# EAGLE design line_adapter (EAGLE 8.5.2)
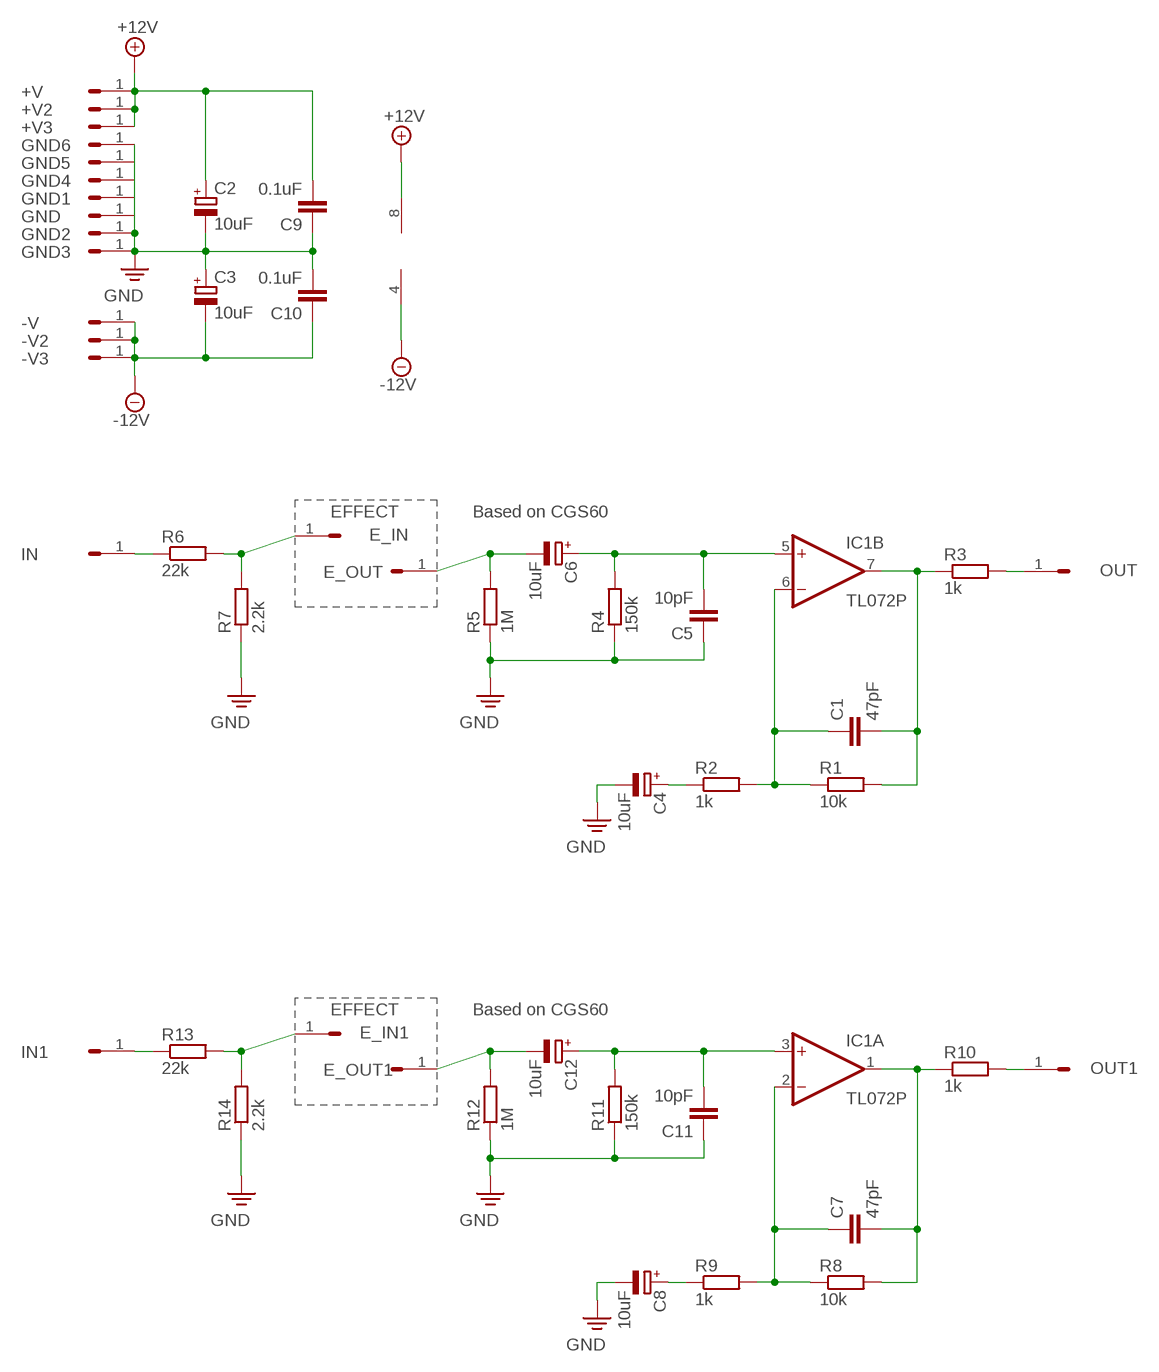
[diagram p0: schematic, sheet 1]

## Parts
+V  HEADER/MALE/01  [HEADER/MALE/01]
+V2  HEADER/MALE/01  [HEADER/MALE/01]
+V3  HEADER/MALE/01  [HEADER/MALE/01]
-V  HEADER/MALE/01  [HEADER/MALE/01]
-V2  HEADER/MALE/01  [HEADER/MALE/01]
-V3  HEADER/MALE/01  [HEADER/MALE/01]
C1  47pF  CAPACITORCERAMICDISC/5  [CERAMICDISC/5]
C2  10uF  CAPACITOR/POLARIZEDE2.5-6  [E2,5-6]
C3  10uF  CAPACITOR/POLARIZEDE2.5-6  [E2,5-6]
C4  10uF  CAPACITOR/POLARIZEDE2.5-6  [E2,5-6]
C5  10pF  CAPACITORCERAMICDISC/5  [CERAMICDISC/5]
C6  10uF  CAPACITOR/POLARIZEDE2.5-6  [E2,5-6]
C7  47pF  CAPACITORCERAMICDISC/5  [CERAMICDISC/5]
C8  10uF  CAPACITOR/POLARIZEDE2.5-6  [E2,5-6]
C9  0.1uF  CAPACITORCERAMICDISC/5  [CERAMICDISC/5]
C10  0.1uF  CAPACITORCERAMICDISC/5  [CERAMICDISC/5]
C11  10pF  CAPACITORCERAMICDISC/5  [CERAMICDISC/5]
C12  10uF  CAPACITOR/POLARIZEDE2.5-6  [E2,5-6]
E_IN  HEADER/MALE/01  [HEADER/MALE/01]
E_IN1  HEADER/MALE/01  [HEADER/MALE/01]
E_OUT  HEADER/MALE/01  [HEADER/MALE/01]
E_OUT1  HEADER/MALE/01  [HEADER/MALE/01]
GND  HEADER/MALE/01  [HEADER/MALE/01]
GND1  HEADER/MALE/01  [HEADER/MALE/01]
GND2  HEADER/MALE/01  [HEADER/MALE/01]
GND3  HEADER/MALE/01  [HEADER/MALE/01]
GND4  HEADER/MALE/01  [HEADER/MALE/01]
GND5  HEADER/MALE/01  [HEADER/MALE/01]
GND6  HEADER/MALE/01  [HEADER/MALE/01]
IC1  TL072P  [DIL08]
IN  HEADER/MALE/01  [HEADER/MALE/01]
IN1  HEADER/MALE/01  [HEADER/MALE/01]
OUT  HEADER/MALE/01  [HEADER/MALE/01]
OUT1  HEADER/MALE/01  [HEADER/MALE/01]
R1  10k  RESISTORRESISTOR/UPRIGHT/7.5  [RESISTOR/7.5]
R2  1k  RESISTORRESISTOR/UPRIGHT/7.5  [RESISTOR/7.5]
R3  1k  RESISTORRESISTOR/UPRIGHT/7.5  [RESISTOR/7.5]
R4  150k  RESISTORRESISTOR/UPRIGHT/7.5  [RESISTOR/7.5]
R5  1M  RESISTORRESISTOR/UPRIGHT/7.5  [RESISTOR/7.5]
R6  22k  RESISTORRESISTOR/UPRIGHT/7.5  [RESISTOR/7.5]
R7  2.2k  RESISTORRESISTOR/UPRIGHT/7.5  [RESISTOR/7.5]
R8  10k  RESISTORRESISTOR/UPRIGHT/7.5  [RESISTOR/7.5]
R9  1k  RESISTORRESISTOR/UPRIGHT/7.5  [RESISTOR/7.5]
R10  1k  RESISTORRESISTOR/UPRIGHT/7.5  [RESISTOR/7.5]
R11  150k  RESISTORRESISTOR/UPRIGHT/7.5  [RESISTOR/7.5]
R12  1M  RESISTORRESISTOR/UPRIGHT/7.5  [RESISTOR/7.5]
R13  22k  RESISTORRESISTOR/UPRIGHT/7.5  [RESISTOR/7.5]
R14  2.2k  RESISTORRESISTOR/UPRIGHT/7.5  [RESISTOR/7.5]

## Nets
+12V: +V2.1 +V3.1 +V.1 C2.+ C9.2 IC1.8(P:V+)
-12V: -V2.1 -V3.1 -V.1 C3.- C10.1 IC1.4(P:V-)
GND: C2.- C3.+ C4.- C5.1 C8.- C9.1 C10.2 C11.1 GND1.1 GND2.1 GND3.1 GND4.1 GND5.1 GND6.1 GND.1 R4.1 R5.1 R7.1 R11.1 R12.1 R14.1
N$1: C1.2 IC1.7(B:OUT) R1.2 R3.1
N$2: C1.1 IC1.6(B:-IN) R1.1 R2.2
N$3: C4.+ R2.1
N$4: C5.2 C6.+ IC1.5(B:+IN) R4.2
N$5: E_IN.1 R6.2 R7.2
N$6: IN.1 R6.1
N$7: C6.- E_OUT.1 R5.2
N$8: C7.2 IC1.1(A:OUT) R8.2 R10.1
N$9: OUT.1 R3.2
N$10: C7.1 IC1.2(A:-IN) R8.1 R9.2
N$11: C8.+ R9.1
N$12: C11.2 C12.+ IC1.3(A:+IN) R11.2
N$13: C12.- E_OUT1.1 R12.2
N$14: OUT1.1 R10.2
N$15: E_IN1.1 R13.2 R14.2
N$16: IN1.1 R13.1

## Notes on the sheet
- EFFECT | Based on CGS60
- EFFECT | Based on CGS60

## Library data of the parts
+V +V2 +V3 -V -V2 -V3 E_IN E_IN1 E_OUT E_OUT1 GND GND1-GND6 IN IN1 OUT OUT1 = connectors:HEADER/MALE/01; SPICEPREFIX: X
C1 C5 C7 C9-C11 = capacitors:CAPACITOR: CAPACITOR, European symbol
C2-C4 C6 C8 C12 = capacitors:CAPACITOR/POLARIZED: POLARIZED CAPACITOR, European symbol; SPICEPREFIX: C
IC1 = ic_analogue:TL072: OP AMP
R1-R14 = resistors:RESISTOR: RESISTOR, European symbol

## Board
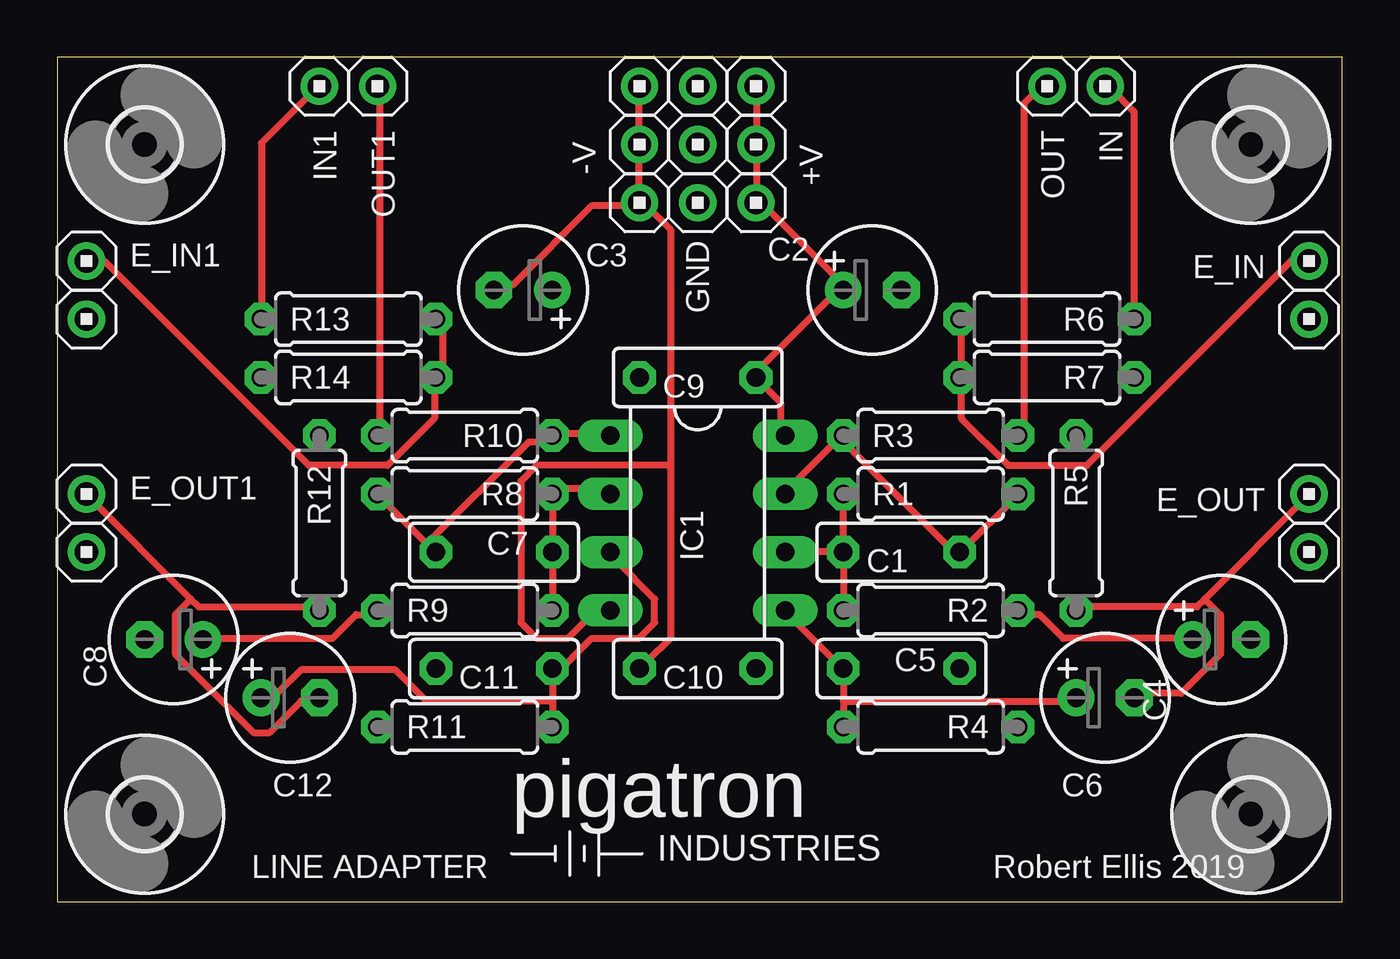
[diagram p1: board, top side]
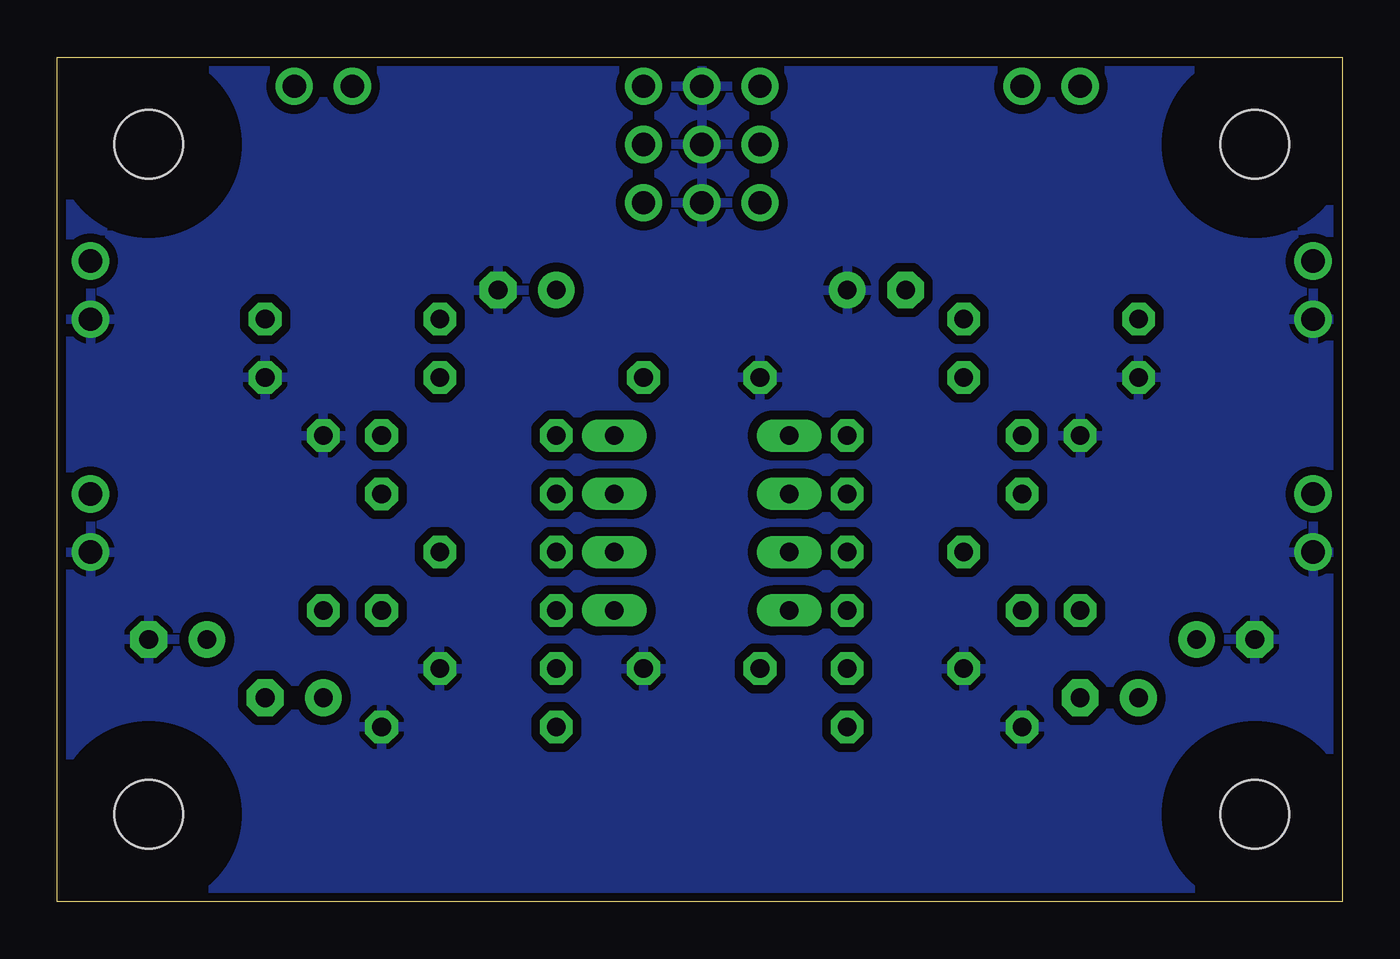
[diagram p2: board, bottom side, seen from below]

Size 56.06 x 36.82 mm. Coordinates in mm from the lower left corner, seen from the top.
Outline: 0,0 56.06,0 56.06,36.82 0,36.82 0,0
Copper layers (1*16): Top 0.0356mm / dielectric 1.5011mm / Bottom 0.0356mm
Design rules "rob": minimum track width 12mil, minimum drill 13mil, track to track 15mil, track to pad 10mil, pad to pad 10mil, via to via 10mil, smd to smd 6mil, copper to edge 15mil, drill to drill 10mil, minimum pad ring 12mil, minimum via ring 10mil, stop-mask expansion 4mil, vias tented up to drill 0mil, thermal gap 10mil

### Footprints (pad centres in the part's own frame; a part is rotated, then mirrored left to right if it is on the bottom)
HEADER/MALE/01 = drill 1.016: 1 0,0
CERAMICDISC/5 = drill 0.813 octagon: 1 -2.54,0; 2 2.54,0
E2,5-6 = drill 0.813 pad 1.6: + -1.27,0 | drill 0.813 pad 1.6 octagon: - 1.27,0
DIL08 = drill 0.813 pad 1.27 long: 1 -3.81,-3.81; 2 -1.27,-3.81; 3 1.27,-3.81; 4 3.81,-3.81; 5 3.81,3.81; 6 1.27,3.81; 7 -1.27,3.81; 8 -3.81,3.81
RESISTOR/7.5 = drill 0.813 octagon: 1 -3.81,0; 2 3.81,0
STANDOFF/3.0 = hole 3: 0,0

### Placement (x,y rotation side)
+V  30.48,35.56 270 top
+V2  30.48,33.02 270 top
+V3  30.48,30.48 270 top
-V  25.4,35.56 270 top
-V2  25.4,33.02 270 top
-V3  25.4,30.48 270 top
C1  36.83,15.24 0 top
C2  35.56,26.67 0 top
C3  20.32,26.67 180 top
C4  50.8,11.43 0 top
C5  36.83,10.16 180 top
C6  45.72,8.89 0 top
C7  19.05,15.24 180 top
C8  5.08,11.43 180 top
C9  27.94,22.86 0 top
C10  27.94,10.16 0 top
C11  19.05,10.16 0 top
C12  10.16,8.89 0 top
E_IN  54.61,27.94 180 top
E_IN1  1.27,27.94 0 top
E_OUT  54.61,17.78 180 top
E_OUT1  1.27,17.78 0 top
GND  27.94,35.56 270 top
GND1  1.27,25.4 0 top
GND2  27.94,33.02 270 top
GND3  27.94,30.48 270 top
GND4  54.61,15.24 270 top
GND5  1.27,15.24 0 top
GND6  54.61,25.4 0 top
IC1  27.94,16.51 270 top
IN  45.72,35.56 270 top
IN1  11.43,35.56 270 top
OUT  43.18,35.56 270 top
OUT1  13.97,35.56 270 top
R1  38.1,17.78 0 top
R2  38.1,12.7 180 top
R3  38.1,20.32 0 top
R4  38.1,7.62 180 top
R5  44.45,16.51 270 top
R6  43.18,25.4 180 top
R7  43.18,22.86 180 top
R8  17.78,17.78 180 top
R9  17.78,12.7 0 top
R10  17.78,20.32 180 top
R11  17.78,7.62 0 top
R12  11.43,16.51 270 top
R13  12.7,25.4 0 top
R14  12.7,22.86 0 top
U$1  [STANDOFF/3.0]  52.07,3.81 0 top
U$2  [STANDOFF/3.0]  52.07,33.02 0 top
U$3  [PIGATRON-LOGO]  28.7,3.68 0 top
U$4  [STANDOFF/3.0]  3.81,3.81 0 top
U$5  [STANDOFF/3.0]  3.81,33.02 0 top

### Tracks (layer width: path | path; a pad name or v marks a point on that pad's centre or on a via)
+12V
  Top 0.305: IC1.8 31.55,20.4 31.55,21.77 30.52,22.8 C9.2 30.52,23.14 34.29,26.91 | 30.52,30.68 34.29,26.91 | 30.52,30.68 30.52,32.74 +V2.1 30.52,33.08 30.52,35.48 +V.1 | 30.52,30.68 +V3.1 | 34.29,26.91 C2.+
-12V
  Top 0.305: 26.75,19.02 26.75,29.31 25.72,30.34 -V3.1 | 26.75,19.02 26.75,11.48 25.72,10.45 C10.1 | 26.75,19.02 20.92,19.02 20.23,18.34 20.23,12.17 20.92,11.48 22.29,11.48 23.32,12.51 24,12.51 IC1.4 | C3.- 19.2,26.91 19.89,26.91 23.32,30.34 25.38,30.34 -V3.1 | -V3.1 25.38,30.68 25.38,32.74 -V2.1 25.38,33.08 25.38,35.48 -V.1
GND
  pour Bottom: 0,0 55.88,0 55.88,36.83 0,36.83
N$1
  Top 0.305: IC1.7 31.89,18 34.29,20.4 R3.1 34.29,20.05 39.09,15.25 C1.2 39.43,15.25 41.83,17.65 R1.2
N$2
  Top 0.305: R2.2 C1.1 34.29,15.25 | 34.29,15.25 31.89,15.25 IC1.6 | 34.29,15.25 R1.1
N$3
  Top 0.305: R2.1 42.18,12.51 42.86,12.51 43.89,11.48 49.38,11.48 C4.+
N$4
  Top 0.305: 34.29,10.11 31.89,12.51 IC1.5 | 34.29,10.11 34.29,8.74 | 34.29,8.74 R4.2 | 34.29,10.11 C5.2 | 34.29,8.74 44.23,8.74 C6.+
N$5
  Top 0.305: R6.2 39.43,25.2 39.43,23.14 R7.2 39.43,22.8 39.43,21.08 41.49,19.02 44.92,19.02 53.84,27.94 E_IN.1
N$6
  Top 0.305: 47.32,25.54 R6.1 46.98,25.54 46.98,34.45 45.95,35.48 IN.1
N$7
  Top 0.305: 50.06,13.2 54.52,17.65 E_OUT.1 | 50.06,13.2 49.72,12.85 44.58,12.85 R5.2 | 50.06,13.2 50.75,12.51 50.75,10.79 49.03,9.08 47.32,9.08 C6.-
N$8
  Top 0.305: IC1.1 24,20.4 21.6,20.4 R10.1 21.26,20.05 20.57,20.05 16.12,15.6 | 16.12,15.6 14.06,17.65 R8.2 | 16.12,15.6 16.46,15.25 C7.2 16.12,15.6
N$9
  Top 0.305: R3.2 42.18,20.4 42.18,34.8 42.86,35.48 OUT.1
N$10
  Top 0.305: R9.2 21.6,12.85 21.6,14.91 C7.1 21.6,15.25 21.6,17.65 R8.1 21.6,18 24,18 IC1.2
N$11
  Top 0.305: R9.1 13.72,12.51 13.03,12.51 12,11.48 6.51,11.48 C8.+
N$12
  Top 0.305: 21.6,9.77 21.6,10.11 C11.2 21.6,9.77 | 21.6,9.77 21.6,8.74 | 21.6,8.74 21.6,7.71 R11.2 | 21.6,9.77 23.32,11.48 25.38,11.48 26.06,12.17 26.06,13.2 24.35,14.91 IC1.3 | 21.6,8.74 16.12,8.74 14.74,10.11 10.63,10.11 9.6,9.08 8.91,9.08 C12.+
N$13
  Top 0.305: 5.83,13.2 1.37,17.65 E_OUT1.1 | 5.83,13.2 6.17,12.85 11.32,12.85 R12.2 | 5.83,13.2 5.14,12.51 5.14,10.79 8.57,7.37 9.26,7.37 10.63,8.74 11.32,8.74 C12.-
N$14
  Top 0.305: R10.2 14.06,20.4 14.06,35.48 OUT1.1
N$15
  Top 0.305: R13.2 16.8,25.2 16.8,23.14 R14.2 16.46,22.8 16.46,21.08 14.4,19.02 10.97,19.02 2.06,27.94 E_IN1.1
N$16
  Top 0.305: R13.1 8.91,25.54 8.91,33.08 11.32,35.48 IN1.1

### Text on the board
tNames: LINE ADAPTER | Robert Ellis 2019